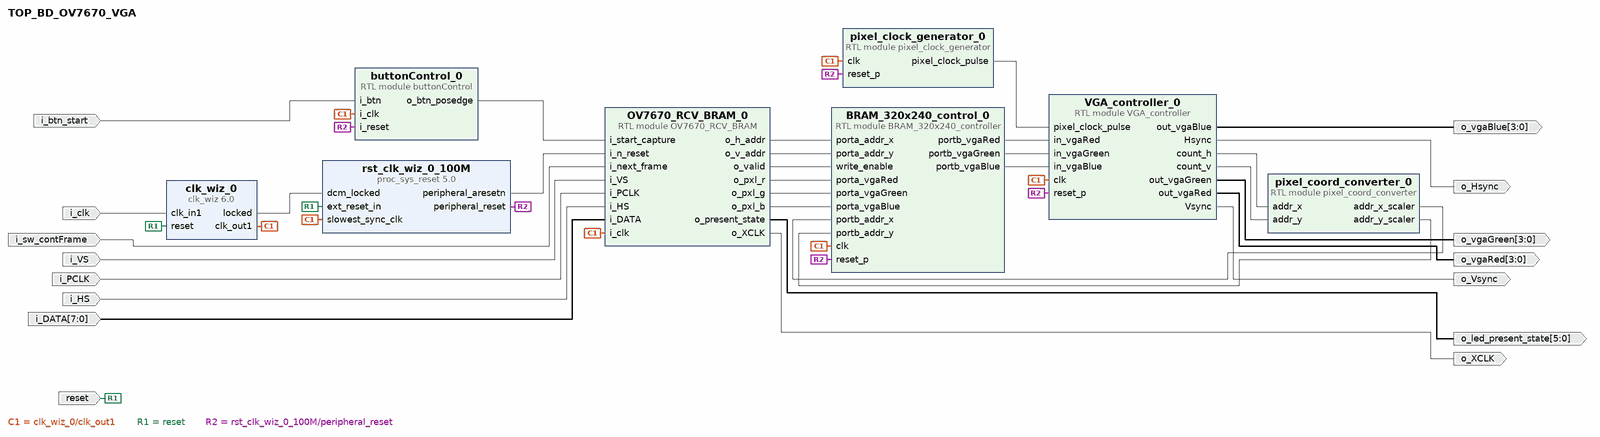
[diagram p0: block diagram of the top level]
# Vivado block design TOP_BD_OV7670_VGA, xc7a35tcpg236-1, Vivado 2019.2
create_bd_design TOP_BD_OV7670_VGA

create_bd_port -dir I i_btn_start
create_bd_port -dir I i_sw_contFrame
create_bd_port -dir I -type clk i_clk
set_property -dict {CONFIG.FREQ_HZ 100000000 CONFIG.PHASE 0.000} [get_bd_ports i_clk]
create_bd_port -dir I -type rst reset
set_property -dict {CONFIG.POLARITY ACTIVE_HIGH} [get_bd_ports reset]
create_bd_port -dir O -from 3 -to 0 o_vgaBlue
create_bd_port -dir O -from 3 -to 0 o_vgaGreen
create_bd_port -dir O -from 3 -to 0 o_vgaRed
create_bd_port -dir O o_Hsync
create_bd_port -dir O o_Vsync
create_bd_port -dir O o_XCLK
create_bd_port -dir I i_VS
create_bd_port -dir I i_PCLK
create_bd_port -dir I i_HS
create_bd_port -dir I -from 7 -to 0 i_DATA
create_bd_port -dir O -from 5 -to 0 o_led_present_state

create_bd_cell -type ip -vlnv xilinx.com:ip:clk_wiz:6.0 clk_wiz_0
set_property -dict [list \
  CONFIG.CLKOUT1_JITTER 130.958 \
  CONFIG.CLKOUT1_PHASE_ERROR 98.575 \
  CONFIG.CLKOUT2_JITTER 202.114 \
  CONFIG.CLKOUT2_PHASE_ERROR 132.063 \
  CONFIG.CLKOUT2_REQUESTED_OUT_FREQ 24.000 \
  CONFIG.CLKOUT2_USED false \
  CONFIG.CLK_IN1_BOARD_INTERFACE sys_clock \
  CONFIG.MMCM_CLKFBOUT_MULT_F 10.000 \
  CONFIG.MMCM_CLKIN1_PERIOD 10.000 \
  CONFIG.MMCM_CLKIN2_PERIOD 10.000 \
  CONFIG.MMCM_CLKOUT0_DIVIDE_F 10.000 \
  CONFIG.MMCM_CLKOUT1_DIVIDE 1 \
  CONFIG.NUM_OUT_CLKS 1 \
  CONFIG.RESET_BOARD_INTERFACE reset \
  CONFIG.USE_BOARD_FLOW true \
] [get_bd_cells clk_wiz_0]
create_bd_cell -type ip -vlnv xilinx.com:ip:proc_sys_reset:5.0 rst_clk_wiz_0_100M
create_bd_cell -type module -reference buttonControl buttonControl_0
create_bd_cell -type module -reference VGA_controller VGA_controller_0
create_bd_cell -type module -reference pixel_clock_generator pixel_clock_generator_0
create_bd_cell -type module -reference BRAM_320x240_controller BRAM_320x240_control_0
create_bd_cell -type module -reference pixel_coord_converter pixel_coord_converter_0
create_bd_cell -type module -reference OV7670_RCV_BRAM OV7670_RCV_BRAM_0

# ---- connections ----

connect_bd_net -net i_btn_0_1 [get_bd_ports i_btn_start] [get_bd_pins buttonControl_0/i_btn]
connect_bd_net -net i_next_frame_0_1 [get_bd_ports i_sw_contFrame] [get_bd_pins OV7670_RCV_BRAM_0/i_next_frame]
connect_bd_net [get_bd_pins buttonControl_0/o_btn_posedge] [get_bd_pins OV7670_RCV_BRAM_0/i_start_capture]
connect_bd_net -net sys_clock_1 [get_bd_ports i_clk] [get_bd_pins clk_wiz_0/clk_in1]
connect_bd_net [get_bd_pins clk_wiz_0/clk_out1] \
  [get_bd_pins rst_clk_wiz_0_100M/slowest_sync_clk] [get_bd_pins buttonControl_0/i_clk] [get_bd_pins VGA_controller_0/clk] \
  [get_bd_pins pixel_clock_generator_0/clk] [get_bd_pins BRAM_320x240_control_0/clk] [get_bd_pins OV7670_RCV_BRAM_0/i_clk]
connect_bd_net [get_bd_pins clk_wiz_0/locked] [get_bd_pins rst_clk_wiz_0_100M/dcm_locked]
connect_bd_net [get_bd_ports reset] [get_bd_pins clk_wiz_0/reset] [get_bd_pins rst_clk_wiz_0_100M/ext_reset_in]
connect_bd_net [get_bd_pins OV7670_RCV_BRAM_0/o_h_addr] [get_bd_pins BRAM_320x240_control_0/porta_addr_x]
connect_bd_net [get_bd_pins OV7670_RCV_BRAM_0/o_v_addr] [get_bd_pins BRAM_320x240_control_0/porta_addr_y]
connect_bd_net [get_bd_pins OV7670_RCV_BRAM_0/o_valid] [get_bd_pins BRAM_320x240_control_0/write_enable]
connect_bd_net [get_bd_pins OV7670_RCV_BRAM_0/o_pxl_r] [get_bd_pins BRAM_320x240_control_0/porta_vgaRed]
connect_bd_net [get_bd_pins OV7670_RCV_BRAM_0/o_pxl_g] [get_bd_pins BRAM_320x240_control_0/porta_vgaGreen]
connect_bd_net [get_bd_pins OV7670_RCV_BRAM_0/o_pxl_b] [get_bd_pins BRAM_320x240_control_0/porta_vgaBlue]
connect_bd_net [get_bd_pins pixel_clock_generator_0/pixel_clock_pulse] [get_bd_pins VGA_controller_0/pixel_clock_pulse]
connect_bd_net [get_bd_pins BRAM_320x240_control_0/portb_vgaRed] [get_bd_pins VGA_controller_0/in_vgaRed]
connect_bd_net [get_bd_pins BRAM_320x240_control_0/portb_vgaGreen] [get_bd_pins VGA_controller_0/in_vgaGreen]
connect_bd_net [get_bd_pins BRAM_320x240_control_0/portb_vgaBlue] [get_bd_pins VGA_controller_0/in_vgaBlue]
connect_bd_net [get_bd_pins VGA_controller_0/out_vgaBlue] [get_bd_ports o_vgaBlue]
connect_bd_net [get_bd_pins VGA_controller_0/out_vgaGreen] [get_bd_ports o_vgaGreen]
connect_bd_net [get_bd_pins VGA_controller_0/out_vgaRed] [get_bd_ports o_vgaRed]
connect_bd_net [get_bd_pins VGA_controller_0/Hsync] [get_bd_ports o_Hsync]
connect_bd_net [get_bd_pins VGA_controller_0/Vsync] [get_bd_ports o_Vsync]
connect_bd_net -net i_VS_0_1 [get_bd_ports i_VS] [get_bd_pins OV7670_RCV_BRAM_0/i_VS]
connect_bd_net -net i_PCLK_0_1 [get_bd_ports i_PCLK] [get_bd_pins OV7670_RCV_BRAM_0/i_PCLK]
connect_bd_net -net i_HS_0_1 [get_bd_ports i_HS] [get_bd_pins OV7670_RCV_BRAM_0/i_HS]
connect_bd_net -net i_DATA_0_1 [get_bd_ports i_DATA] [get_bd_pins OV7670_RCV_BRAM_0/i_DATA]
connect_bd_net [get_bd_pins OV7670_RCV_BRAM_0/o_present_state] [get_bd_ports o_led_present_state]
connect_bd_net [get_bd_pins rst_clk_wiz_0_100M/peripheral_reset] \
  [get_bd_pins VGA_controller_0/reset_p] [get_bd_pins pixel_clock_generator_0/reset_p] [get_bd_pins buttonControl_0/i_reset] \
  [get_bd_pins BRAM_320x240_control_0/reset_p]
connect_bd_net [get_bd_pins rst_clk_wiz_0_100M/peripheral_aresetn] [get_bd_pins OV7670_RCV_BRAM_0/i_n_reset]
connect_bd_net [get_bd_pins OV7670_RCV_BRAM_0/o_XCLK] [get_bd_ports o_XCLK]
connect_bd_net [get_bd_pins VGA_controller_0/count_h] [get_bd_pins pixel_coord_converter_0/addr_x]
connect_bd_net [get_bd_pins VGA_controller_0/count_v] [get_bd_pins pixel_coord_converter_0/addr_y]
connect_bd_net [get_bd_pins pixel_coord_converter_0/addr_x_scaler] [get_bd_pins BRAM_320x240_control_0/portb_addr_x]
connect_bd_net [get_bd_pins pixel_coord_converter_0/addr_y_scaler] [get_bd_pins BRAM_320x240_control_0/portb_addr_y]

validate_bd_design
save_bd_design
